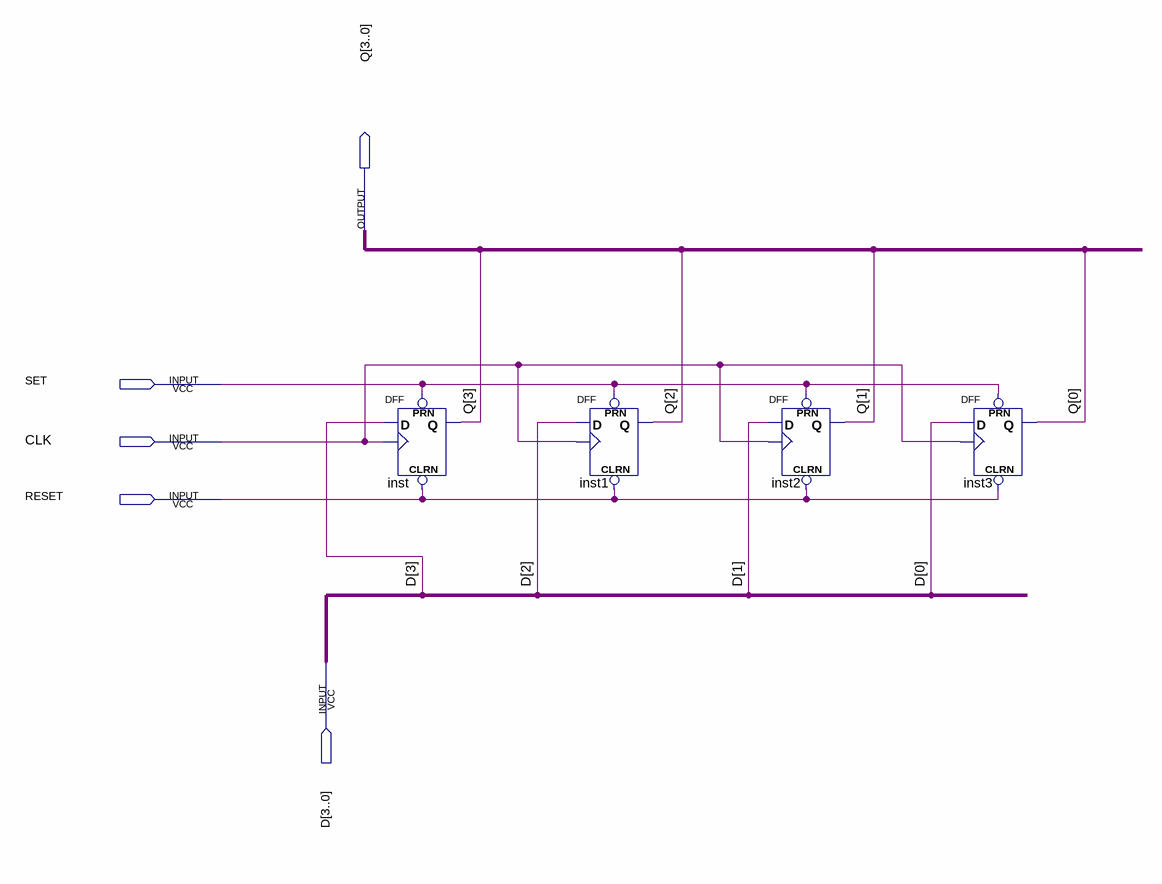
[diagram p0: schematic sheet]
// Quartus schematic regbdf.bdf as structural Verilog: 4 symbols, 5 pins
module regbdf (
  input  SET,
  input  CLK,
  input  RESET,
  input  [3:0] D,
  output [3:0] Q
);

  DFF inst (.CLRN(RESET), .CLK(CLK), .D(D[3]), .PRN(SET), .Q(Q[3]));
  DFF inst1 (.CLRN(RESET), .CLK(CLK), .D(D[2]), .PRN(SET), .Q(Q[2]));
  DFF inst2 (.CLRN(RESET), .CLK(CLK), .D(D[1]), .PRN(SET), .Q(Q[1]));
  DFF inst3 (.CLRN(RESET), .CLK(CLK), .D(D[0]), .PRN(SET), .Q(Q[0]));
endmodule
